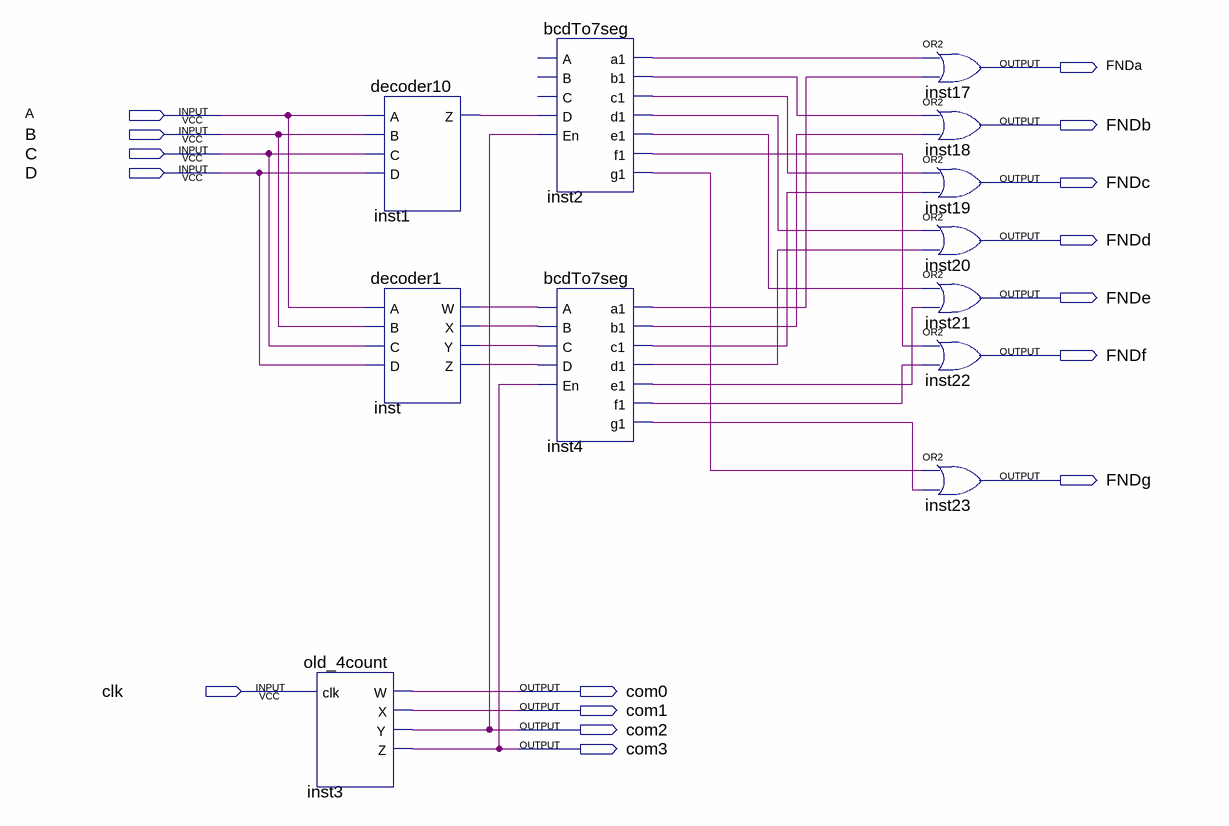
[diagram p0: schematic sheet]
// Quartus schematic fffnd.bdf as structural Verilog: 12 symbols, 16 pins
module fffnd (
  input  A,
  input  B,
  input  C,
  input  D,
  input  clk,
  output FNDa,
  output FNDb,
  output FNDc,
  output FNDd,
  output FNDe,
  output FNDf,
  output FNDg,
  output com0,
  output com1,
  output com2,
  output com3
);

  wire inst1_z, inst2_a1, inst2_b1, inst2_c1, inst2_d1, inst2_e1, inst2_f1, inst2_g1, inst4_a1, inst4_b1,
       inst4_c1, inst4_d1, inst4_e1, inst4_f1, inst4_g1, inst_w, inst_x, inst_y, inst_z;

  decoder10 inst1 (.A(A), .B(B), .C(C), .D(D), .Z(inst1_z));
  decoder1 inst (.A(A), .B(B), .C(C), .D(D), .W(inst_w), .X(inst_x), .Y(inst_y), .Z(inst_z));
  old_4count inst3 (.clk(clk), .W(com0), .X(com1), .Y(com2), .Z(com3));
  bcdTo7seg inst2 (
    .D(inst1_z), .En(com2), .a1(inst2_a1), .b1(inst2_b1), .c1(inst2_c1), .d1(inst2_d1), .e1(inst2_e1),
    .f1(inst2_f1), .g1(inst2_g1));  // open: A, B, C
  bcdTo7seg inst4 (
    .A(inst_w), .B(inst_x), .C(inst_y), .D(inst_z), .En(com3), .a1(inst4_a1), .b1(inst4_b1), .c1(inst4_c1),
    .d1(inst4_d1), .e1(inst4_e1), .f1(inst4_f1), .g1(inst4_g1));
  or inst17 (FNDa, inst2_a1, inst4_a1);
  or inst18 (FNDb, inst2_b1, inst4_b1);
  or inst19 (FNDc, inst2_c1, inst4_c1);
  or inst20 (FNDd, inst2_d1, inst4_d1);
  or inst21 (FNDe, inst2_e1, inst4_e1);
  or inst22 (FNDf, inst2_f1, inst4_f1);
  or inst23 (FNDg, inst2_g1, inst4_g1);
endmodule
